# EAGLE schematic 5DC to 3.3DC(digital output and part of analg output ) (EAGLE 9.6.2)
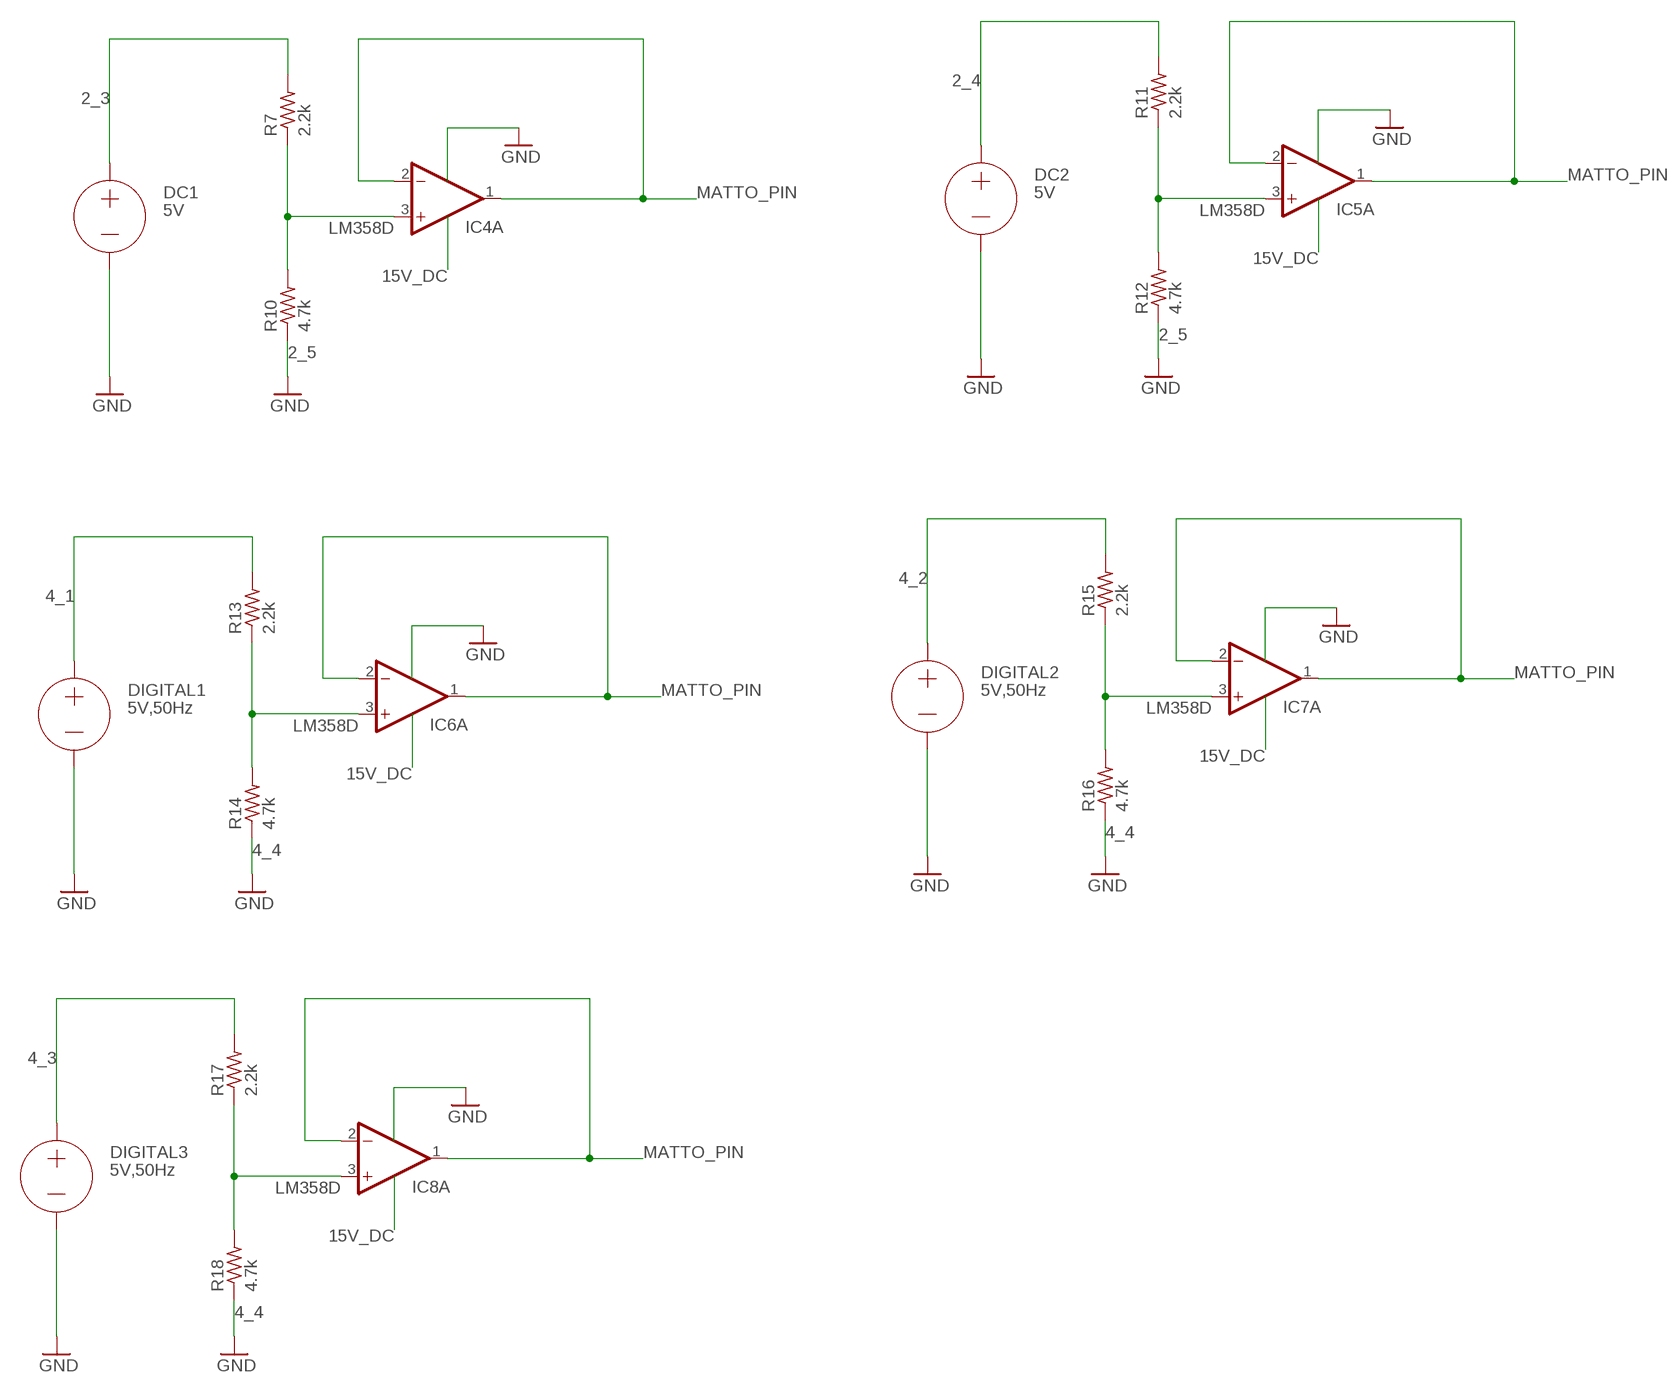
[diagram p0: schematic, sheet 1]

## Parts
DC1  5V  VOLTAGE  (no package)
DC2  5V  VOLTAGE  (no package)
DIGITAL1  5V,50Hz  VOLTAGE  (no package)
DIGITAL2  5V,50Hz  VOLTAGE  (no package)
DIGITAL3  5V,50Hz  VOLTAGE  (no package)
IC4  LM358D  [SO08]
IC5  LM358D  [SO08]
IC6  LM358D  [SO08]
IC7  LM358D  [SO08]
IC8  LM358D  [SO08]
R7  2.2k  R-US_0204/7  [0204/7]
R10  4.7k  R-US_0204/7  [0204/7]
R11  2.2k  R-US_0204/7  [0204/7]
R12  4.7k  R-US_0204/7  [0204/7]
R13  2.2k  R-US_0204/7  [0204/7]
R14  4.7k  R-US_0204/7  [0204/7]
R15  2.2k  R-US_0204/7  [0204/7]
R16  4.7k  R-US_0204/7  [0204/7]
R17  2.2k  R-US_0204/7  [0204/7]
R18  4.7k  R-US_0204/7  [0204/7]

## Nets
2_3: DC1.+ R7.2
2_4: DC2.+ R11.2
2_5: R10.1 R12.1 ; supply symbol labelled GND
4_1: DIGITAL1.+ R13.2
4_2: DIGITAL2.+ R15.2
4_3: DIGITAL3.+ R17.2
4_4: R14.1 R16.1 R18.1 ; supply symbol labelled GND
GND: DC1.- DC2.- DIGITAL1.- DIGITAL2.- DIGITAL3.-
MATTO_PIN: IC4.1(A:OUT) IC4.2(A:-IN) IC5.1(A:OUT) IC5.2(A:-IN) IC6.1(A:OUT) IC6.2(A:-IN) IC7.1(A:OUT) IC7.2(A:-IN) IC8.1(A:OUT) IC8.2(A:-IN)
N$21: IC4.3(A:+IN) R7.1 R10.2
N$22: IC5.3(A:+IN) R11.1 R12.2
N$23: IC6.3(A:+IN) R13.1 R14.2
N$24: IC7.3(A:+IN) R15.1 R16.2
N$25: IC8.3(A:+IN) R17.1 R18.2
Unconnected: IC4.5(B:+IN) IC4.6(B:-IN) IC4.7(B:OUT) IC5.5(B:+IN) IC5.6(B:-IN) IC5.7(B:OUT) IC6.5(B:+IN) IC6.6(B:-IN) IC6.7(B:OUT) IC7.5(B:+IN) IC7.6(B:-IN) IC7.7(B:OUT) IC8.5(B:+IN) IC8.6(B:-IN) IC8.7(B:OUT)

## Power pins joined to a net without a drawn wire
V+: IC4.8(P:V+) IC5.8(P:V+) IC6.8(P:V+) IC7.8(P:V+) IC8.8(P:V+)
V-: IC4.4(P:V-) IC5.4(P:V-) IC6.4(P:V-) IC7.4(P:V-) IC8.4(P:V-)

## Library data of the parts
DC1 DC2 DIGITAL1-DIGITAL3 = ngspice-simulation:VOLTAGE: Independent Voltage Source, either DC, AC, PULSE, SINE, PWL, EXP, or SFFM; VALUE: 0V
IC4-IC8 = linear:LM358: OP AMP also LM158; LM258; LM2904 Source: http://cache.national.com/ds/LM/LM158.pdf
R7 R10-R18 = rcl:R-US_: RESISTOR, American symbol; SPICEPREFIX: R